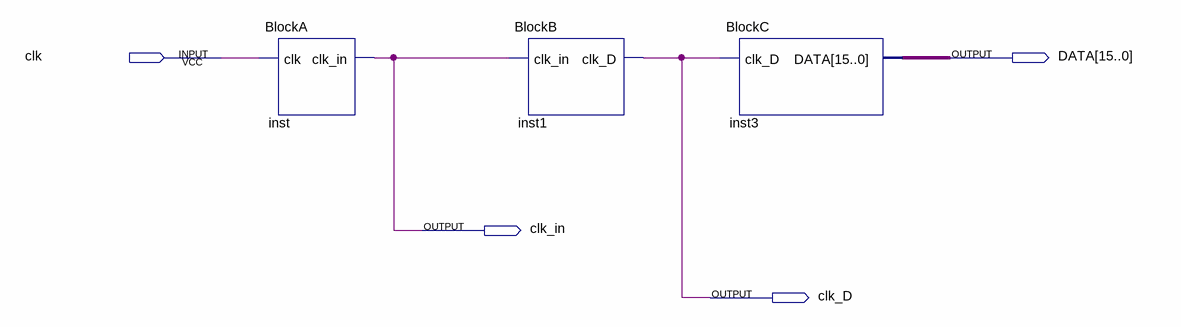
[diagram p0: schematic sheet]
// Quartus schematic lab02.bdf as structural Verilog: 3 symbols, 4 pins
module lab02 (
  input  clk,
  output [15:0] DATA,
  output clk_in,
  output clk_D
);

  BlockA inst (.clk(clk), .clk_in(clk_in));
  BlockB inst1 (.clk_in(clk_in), .clk_D(clk_D));
  BlockC inst3 (.clk_D(clk_D), .DATA(DATA));
endmodule
